# EAGLE schematic PhatStats Slim Enclosure QTPY PCB  v0.93 (EAGLE 7.6.0)
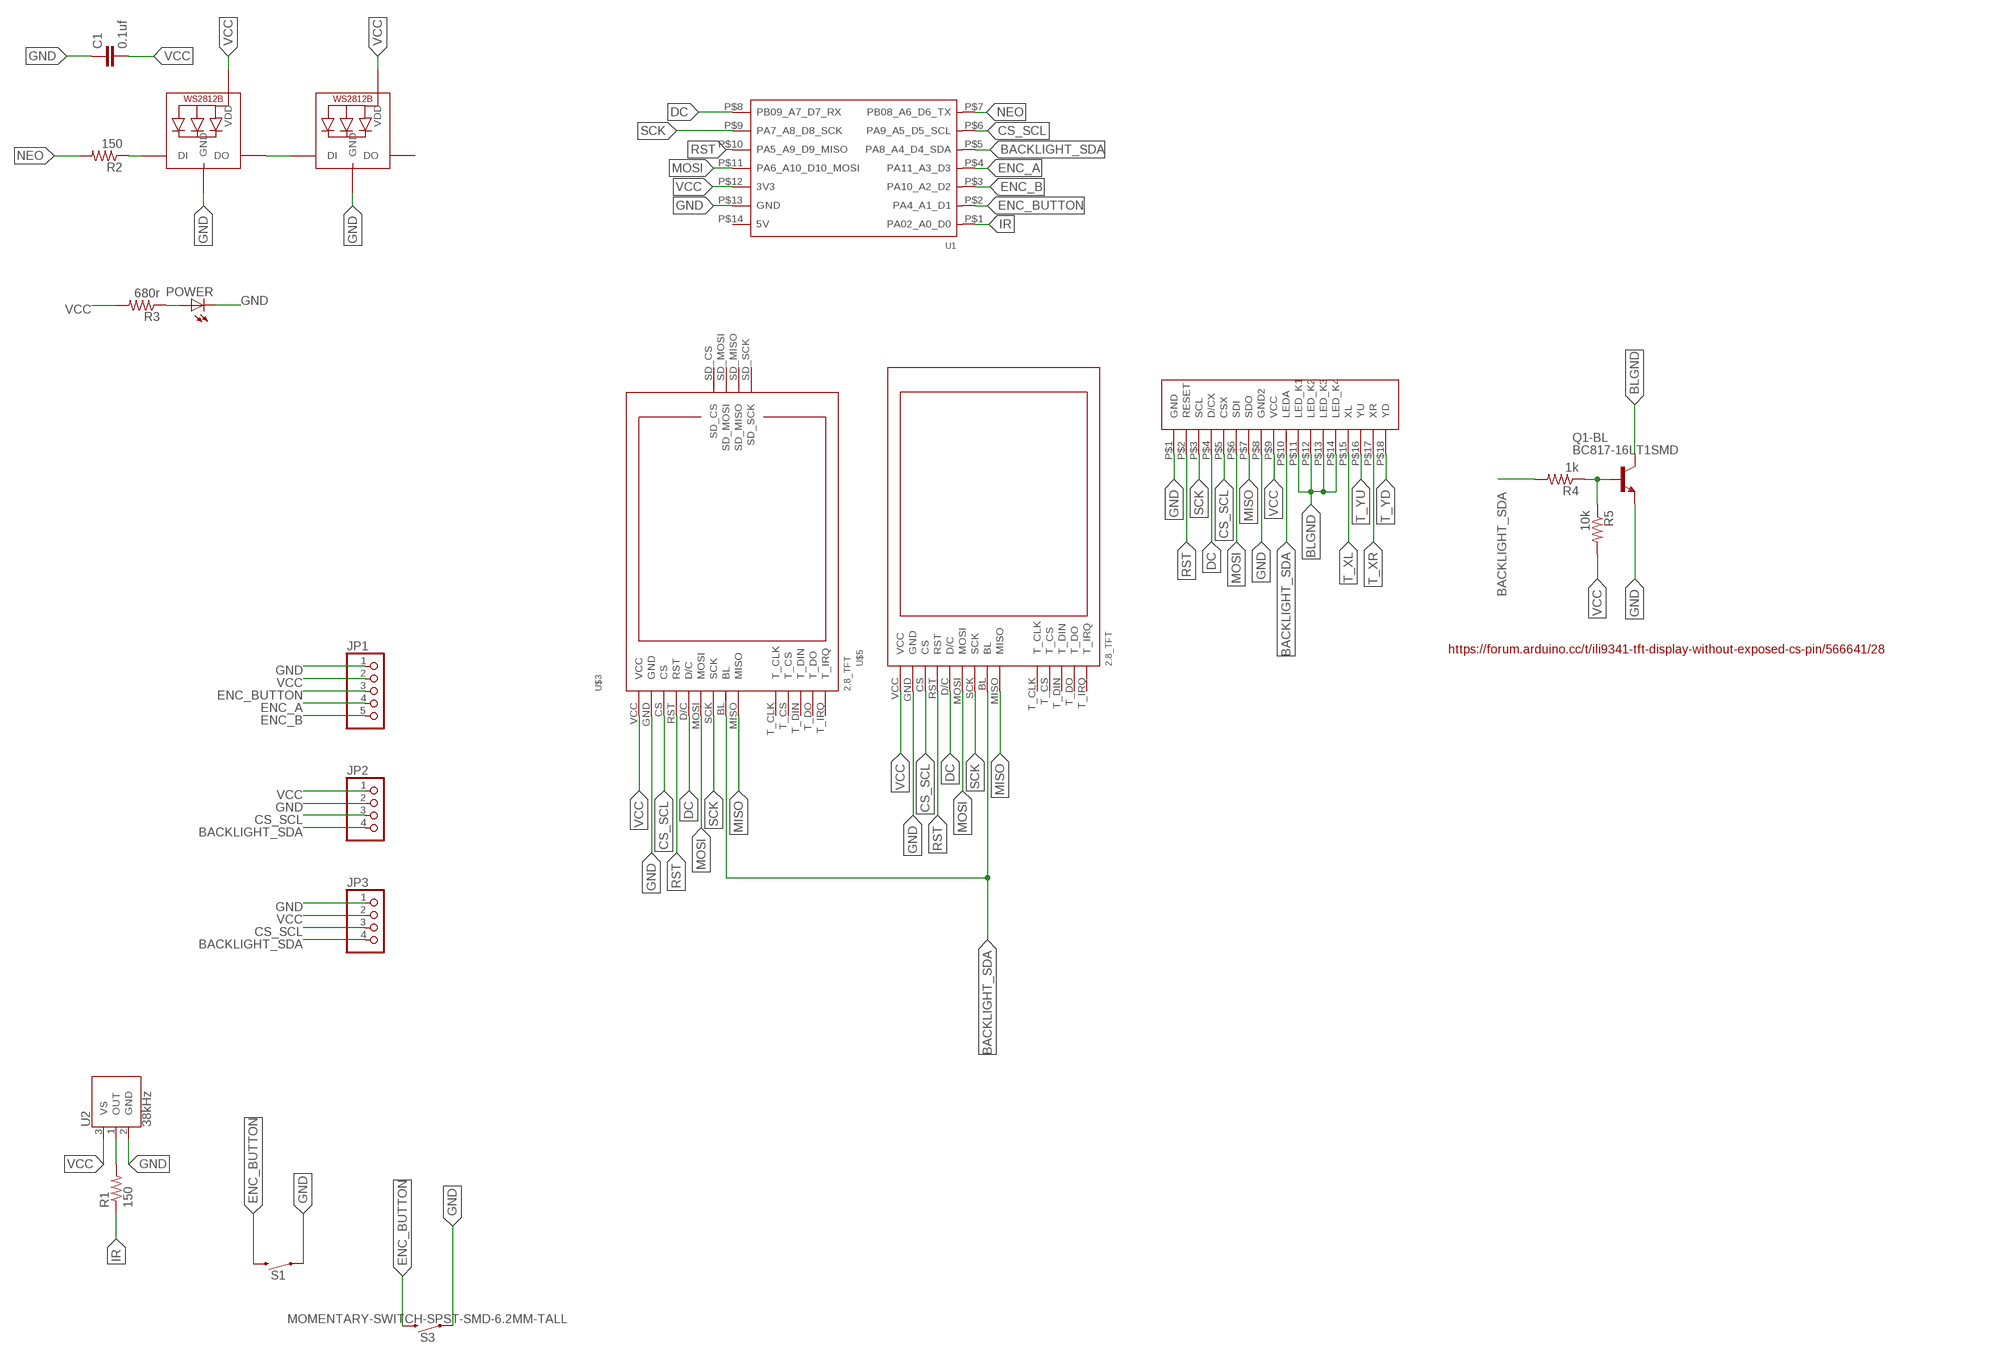
[diagram p0: schematic, sheet 1]

## Parts
0  ILI9341-2.8  [ILI9341-2.8]
C1  0.1uf  C-EUC1206  [C1206]
JP1  PINHD-1X5  [1X05]
JP2  PINHD-1X4  [1X04]
JP3  PINHD-1X4  [1X04]
NEO1  WS2812B5050  [WS2812B]
NEO2  WS2812B5050  [WS2812B]
POWER  LEDCHIPLED_1206  [CHIPLED_1206]
Q1-BL  BC817-16LT1SMD  [SOT23-BEC]
R1  150  R-US_M1206  [M1206]
R2  150  R-US_M1206  [M1206]
R3  680r  R-US_M1206  [M1206]
R4  1k  R-US_M1206  [M1206]
R5  10k  R-US_M1206  [M1206]
S1  MOMENTARY-SWITCH-SPST-PTH-6.0MM  [TACTILE_SWITCH_PTH_6.0MM]
S3  MOMENTARY-SWITCH-SPST-SMD-6.2MM-TALL  [TACTILE_SWITCH_SMD_6.2MM_TALL]
U1  MOUDLE-SEEEDUINO-XIAO  [MOUDLE14P-2.54-21X17.8MM]
U2  38kHz  TSOP38238  [TSOP382]
U$3  2.8_TFT  [2.8_TFT]
U$5  2.8_TFT  [2.8_TFT]

## Nets
BACKLIGHT_SDA: 0.P$10(LEDA) JP2.4 JP3.4 R4.2 U1.P$5(PA8_A4_D4_SDA) U$3.BL U$5.BL
BLGND: 0.P$11(LED_K1) 0.P$12(LED_K2) 0.P$13(LED_K3) 0.P$14(LED_K4) Q1-BL.C
CS_SCL: 0.P$5(CSX) JP2.3 JP3.3 U1.P$6(PA9_A5_D5_SCL) U$3.CS U$5.CS
DC: 0.P$4(D/CX) U1.P$8(PB09_A7_D7_RX) U$3.D/C U$5.D/C
ENC_A: JP1.4 U1.P$4(PA11_A3_D3)
ENC_B: JP1.5 U1.P$3(PA10_A2_D2)
ENC_BUTTON: JP1.3 S1.3 S3.B2 U1.P$2(PA4_A1_D1)
GND: 0.P$1(GND) 0.P$8(GND2) C1.1 JP1.1 JP2.2 JP3.1 NEO1.3-GND(GND) NEO2.3-GND(GND) POWER.C Q1-BL.E S1.1 S3.A2 U1.P$13(GND) U2.2(GND) U$3.GND U$5.GND
IR: R1.1 U1.P$1(PA02_A0_D0)
MISO: 0.P$7(SDO) U$3.MISO U$5.MISO
MOSI: 0.P$6(SDI) U1.P$11(PA6_A10_D10_MOSI) U$3.MOSI U$5.MOSI
N$1: POWER.A R3.1
N$2: Q1-BL.B R4.1 R5.1
N$3: R1.2 U2.1(OUT)
N$4: NEO1.4-DIN(DI) R2.1
NEO: R2.2 U1.P$7(PB08_A6_D6_TX)
NEODATA: NEO1.2-DOUT(DO) NEO2.4-DIN(DI)
RST: 0.P$2(RESET) U1.P$10(PA5_A9_D9_MISO) U$3.RST U$5.RST
SCK: 0.P$3(SCL) U1.P$9(PA7_A8_D8_SCK) U$3.SCK U$5.SCK
T_XL: 0.P$15(XL)
T_XR: 0.P$17(XR)
T_YD: 0.P$18(YD)
T_YU: 0.P$16(YU)
VCC: 0.P$9(VCC) C1.2 JP1.2 JP2.1 JP3.2 NEO1.1-VDD(VDD) NEO2.1-VDD(VDD) R3.2 R5.2 U1.P$12(3V3) U2.3(VS) U$3.VCC U$5.VCC
Unconnected: NEO2.2-DOUT(DO) U1.P$14(5V) U$3.SD_CS U$3.SD_MISO U$3.SD_MOSI U$3.SD_SCK U$3.T_CLK U$3.T_CS U$3.T_DIN U$3.T_DO U$3.T_IRQ U$5.T_CLK U$5.T_CS U$5.T_DIN U$5.T_DO U$5.T_IRQ

## Notes on the sheet
- https://forum.arduino.cc/t/ili9341-tft-display-without-exposed-cs-pin/566641/28

## Library data of the parts
0 = TML_ili9341_0.8Pitch_Header:ILI9341-2.8
C1 = rcl:C-EU: CAPACITOR, European symbol; SPICEPREFIX: C
JP1 = pinhead:PINHD-1X5: PIN HEADER
JP2 JP3 = pinhead:PINHD-1X4: PIN HEADER
NEO1 NEO2 = adafruit:WS2812B
POWER = adafruit:LED: LED OSRAM: - CHIPLED LG R971, LG N971, LY N971, LG Q971, LY Q971, LO R971, LY R971 LH N974, LH R974 LS Q976, LO Q976, LY Q976 LO Q996 - Hyper CHIPLED LW Q18S LB Q993, LB Q99A, LB R99A - SideLED LS A670, LO A670, LY A670, LG A670, LP A670 LB A673, LV A673, LT A673, LW A673 LH A674 LY A675 LS A676, LA A676, LO A676, LY A676, LW A676 LS A679, LY A679, LG A679 - Hyper Micro SIDELED® LS Y876, LA Y876, LO Y876, LY Y876 LT Y87S - SmartLED LW L88C, LW L88S LB L89C, LB L89S, LG L890 LS L89K, LO L89K, LY L89K LS L896, LA L896, LO L896, LY L896 - TOPLED LS T670, LO T670, LY T670, LG T670, LP T670 LSG T670, LSP T670, LSY T670, LOP T670, LYG T670 LG T671, LOG T671, LSG T671 LB T673, LV T673, LT T673, LW T673 LH T674 LS T676, LA T676, LO T676, LY T676, LB T676, LH T676, LSB T676, LW T676 LB T67C, LV T67C, LT T67C, LS T67K, LO T67K, LY T67K, LW E67C LS E67B, LA E67B, LO E67B, LY E67B, LB E67C, LV E67C, LT E67C LW T67C LS T679, LY T679, LG T679 LS T770, LO T770, LY T770, LG T770, LP T770 LB T773, LV T773, LT T773, LW T773 LH T774 LS E675, LA E675, LY E675, LS T675 LS T776, LA T776, LO T776, LY T776, LB T776 LHGB T686 LT T68C, LB T68C - Hyper Mini TOPLED® LB M676 - Mini TOPLED Santana® LG M470 LS M47K, LO M47K, LY M47K Source: http://www.osram.convergy.de/
Q1-BL = transistor-npn:BC817*: NPN Transistor
R1-R5 = resistor:R-US_: RESISTOR, American symbol
S1 = SparkFun-Switches:MOMENTARY-SWITCH-SPST: Momentary Switch (Pushbutton) - SPST Normally-open (NO) SPST momentary switches (buttons, pushbuttons). Variants PTH-12MM - 12mm square, through-hole Momentary Pushbutton Switch - 12mm Square <https://www.sparkfun.com/products/9190> (COM-09190) PTH-6.0MM, PTH-6.0MM-KIT - 6.0mm square, through-hole Mini Pushbutton Switch <https://www.sparkfun.com/products/97> (COM-00097) KIT package intended for soldering kit's - only one side of pads' copper is exposed. PTH-RIGHT-ANGLE-KIT - Right-angle, through-hole Right Angle Tactile Button <https://www.sparkfun.com/products/10791> - Used on SparkFun BigTime Watch Kit <https://www.sparkfun.com/products/11734> SMD-12MM - 12mm square, surface-mount Tactile Button - SMD (12mm) <https://www.sparkfun.com/products/12993> (COM-12993) Used on SparkFun PicoBoard <https://www.sparkfun.com/products/11888> SMD-4.5MM - 4.5mm Square Trackball Switch Used on SparkFun Blackberry Trackballer Breakout <https://www.sparkfun.com/products/13169> SMD-4.6MMX2.8MM - 4.60mm x 2.80mm, surface mount Used on SparkFun SAMD21 Mini Breakout <https://www.sparkfun.com/products/13664> SMD-5.2MM, SMD-5.2-REDUNDANT - 5.2mm square, surface-mount Mini Pushbutton Switch - SMD <https://www.sparkfun.com/products/8720> (COM-08720) Used on Arduino Pro Mini <https://www.sparkfun.com/products/11114> REDUNDANT package connects both switch circuits together SMD-6.0X3.5MM - 6.0 x 3.5mm, surface mount Momentary Reset Switch SMD <https://www.sparkfun.com/products/8229> (COM-08229) SMD-6.2MM-TALL - 6.2mm square, surface mount Tactile Button - SMD (6mm) <https://www.sparkfun.com/products/12992> Used on SparkFun Digital Sandbox <https://www.sparkfun.com/products/12651> SMD-RIGHT-ANGLE - Right-angle, surface mount Used on SparkFun Block for Intel® Edison - Arduino <https://www.sparkfun.com/products/13036>; PROD_ID: SWCH-08441; SF_SKU: COM-00097
S3 = SparkFun-Switches:MOMENTARY-SWITCH-SPST: Momentary Switch (Pushbutton) - SPST Normally-open (NO) SPST momentary switches (buttons, pushbuttons). Variants PTH-12MM - 12mm square, through-hole Momentary Pushbutton Switch - 12mm Square <https://www.sparkfun.com/products/9190> (COM-09190) PTH-6.0MM, PTH-6.0MM-KIT - 6.0mm square, through-hole Mini Pushbutton Switch <https://www.sparkfun.com/products/97> (COM-00097) KIT package intended for soldering kit's - only one side of pads' copper is exposed. PTH-RIGHT-ANGLE-KIT - Right-angle, through-hole Right Angle Tactile Button <https://www.sparkfun.com/products/10791> - Used on SparkFun BigTime Watch Kit <https://www.sparkfun.com/products/11734> SMD-12MM - 12mm square, surface-mount Tactile Button - SMD (12mm) <https://www.sparkfun.com/products/12993> (COM-12993) Used on SparkFun PicoBoard <https://www.sparkfun.com/products/11888> SMD-4.5MM - 4.5mm Square Trackball Switch Used on SparkFun Blackberry Trackballer Breakout <https://www.sparkfun.com/products/13169> SMD-4.6MMX2.8MM - 4.60mm x 2.80mm, surface mount Used on SparkFun SAMD21 Mini Breakout <https://www.sparkfun.com/products/13664> SMD-5.2MM, SMD-5.2-REDUNDANT - 5.2mm square, surface-mount Mini Pushbutton Switch - SMD <https://www.sparkfun.com/products/8720> (COM-08720) Used on Arduino Pro Mini <https://www.sparkfun.com/products/11114> REDUNDANT package connects both switch circuits together SMD-6.0X3.5MM - 6.0 x 3.5mm, surface mount Momentary Reset Switch SMD <https://www.sparkfun.com/products/8229> (COM-08229) SMD-6.2MM-TALL - 6.2mm square, surface mount Tactile Button - SMD (6mm) <https://www.sparkfun.com/products/12992> Used on SparkFun Digital Sandbox <https://www.sparkfun.com/products/12651> SMD-RIGHT-ANGLE - Right-angle, surface mount Used on SparkFun Block for Intel® Edison - Arduino <https://www.sparkfun.com/products/13036>; PROD_ID: SWCH-11966; SF_SKU: COM-12992
U1 = TML_Seeeduino XIAO_QTPY_ThroughHole_LongPad:MOUDLE-SEEEDUINO-XIAO
U2 = SparkFun-Sensors:TSOP382: Vishay Semiconductor TSOP32838 - 38kHz IR Receiver These products are miniaturized IR receiver modules for infrared remote control systems. A PIN diode and a preamplifier are assembled on a leadframe, the epoxy package contains an IR filter. The demodulated output signal can be directly connected to a microprocessor for decoding.; PROD_ID: SEN-10266
U$3 = TML_ili9341-2.8_tft-display_Corrected:2.8_TFT: ILI9341 2.8" 2.8 inch TFT SPI Touch Panel 240X320 http://www.lcdwiki.com/2.8inch_SPI_Module_ILI9341_SKU:MSP2807 http://www.lcdwiki.com/Run_Arduino_Demo_in_spi_model
U$5 = TML_ili9341-2.8_tft-display_PinHeader only:2.8_TFT: ILI9341 2.8" 2.8 inch TFT SPI Touch Panel 240X320 http://www.lcdwiki.com/2.8inch_SPI_Module_ILI9341_SKU:MSP2807 http://www.lcdwiki.com/Run_Arduino_Demo_in_spi_model